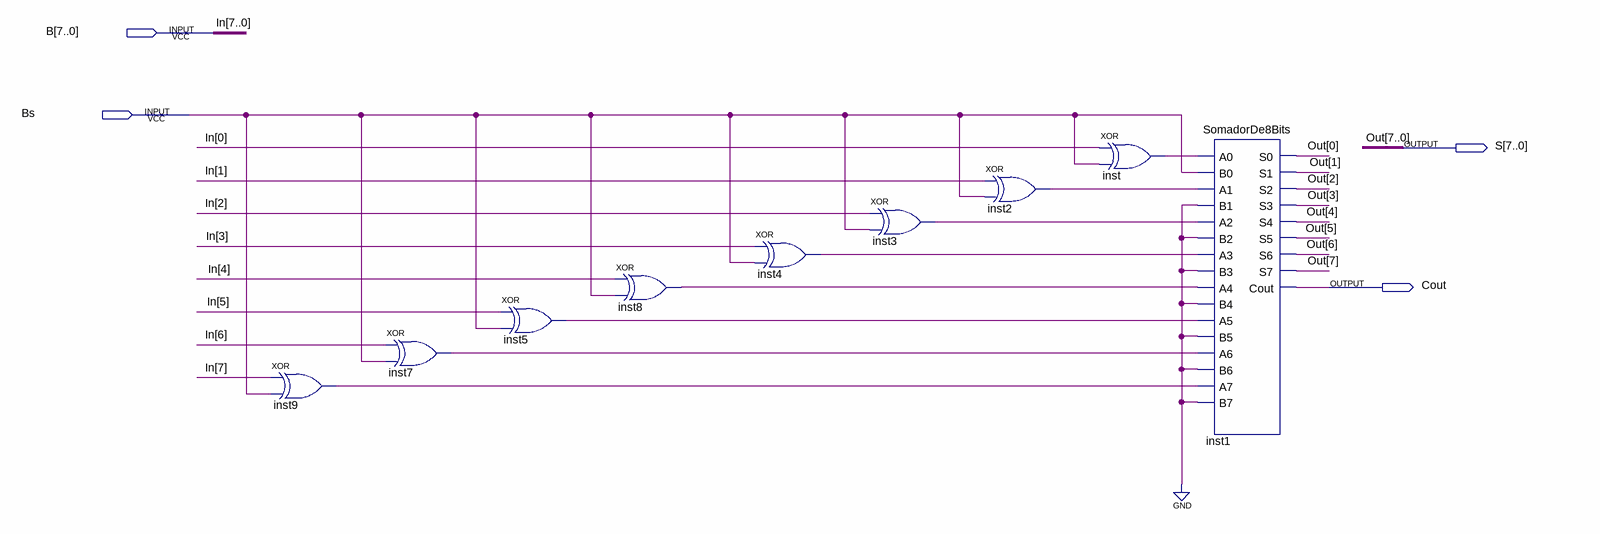
[diagram p0: schematic sheet]
// Quartus schematic InverteSoma1De8Bits.bdf as structural Verilog: 9 symbols, 4 pins
module InverteSoma1De8Bits (
  input  [7:0] B,
  input  Bs,
  output [7:0] S,
  output Cout
);

  wire inst2_out, inst3_out, inst4_out, inst5_out, inst7_out, inst8_out, inst9_out, inst_out;

  xor inst9 (inst9_out, B[7], Bs);
  xor inst7 (inst7_out, B[6], Bs);
  xor inst5 (inst5_out, B[5], Bs);
  xor inst8 (inst8_out, B[4], Bs);
  xor inst4 (inst4_out, B[3], Bs);
  xor inst3 (inst3_out, B[2], Bs);
  xor inst2 (inst2_out, B[1], Bs);
  xor inst (inst_out, B[0], Bs);
  SomadorDe8Bits inst1 (
    .A0(inst_out), .B0(Bs), .A1(inst2_out), .B1(1'b0), .A2(inst3_out), .B2(1'b0), .A3(inst4_out), .B3(1'b0),
    .A4(inst8_out), .B4(1'b0), .A5(inst5_out), .B5(1'b0), .A6(inst7_out), .B6(1'b0), .A7(inst9_out),
    .B7(1'b0), .S0(S[0]), .S1(S[1]), .S2(S[2]), .S3(S[3]), .S4(S[4]), .S5(S[5]), .S6(S[6]), .S7(S[7]),
    .Cout(Cout));

  // Other names for the same wires on the sheet: In[7:0] = B; Out[7:0] = S
endmodule
